# Altium schematic sheet Power.SchDoc
size 297 x 209 mm
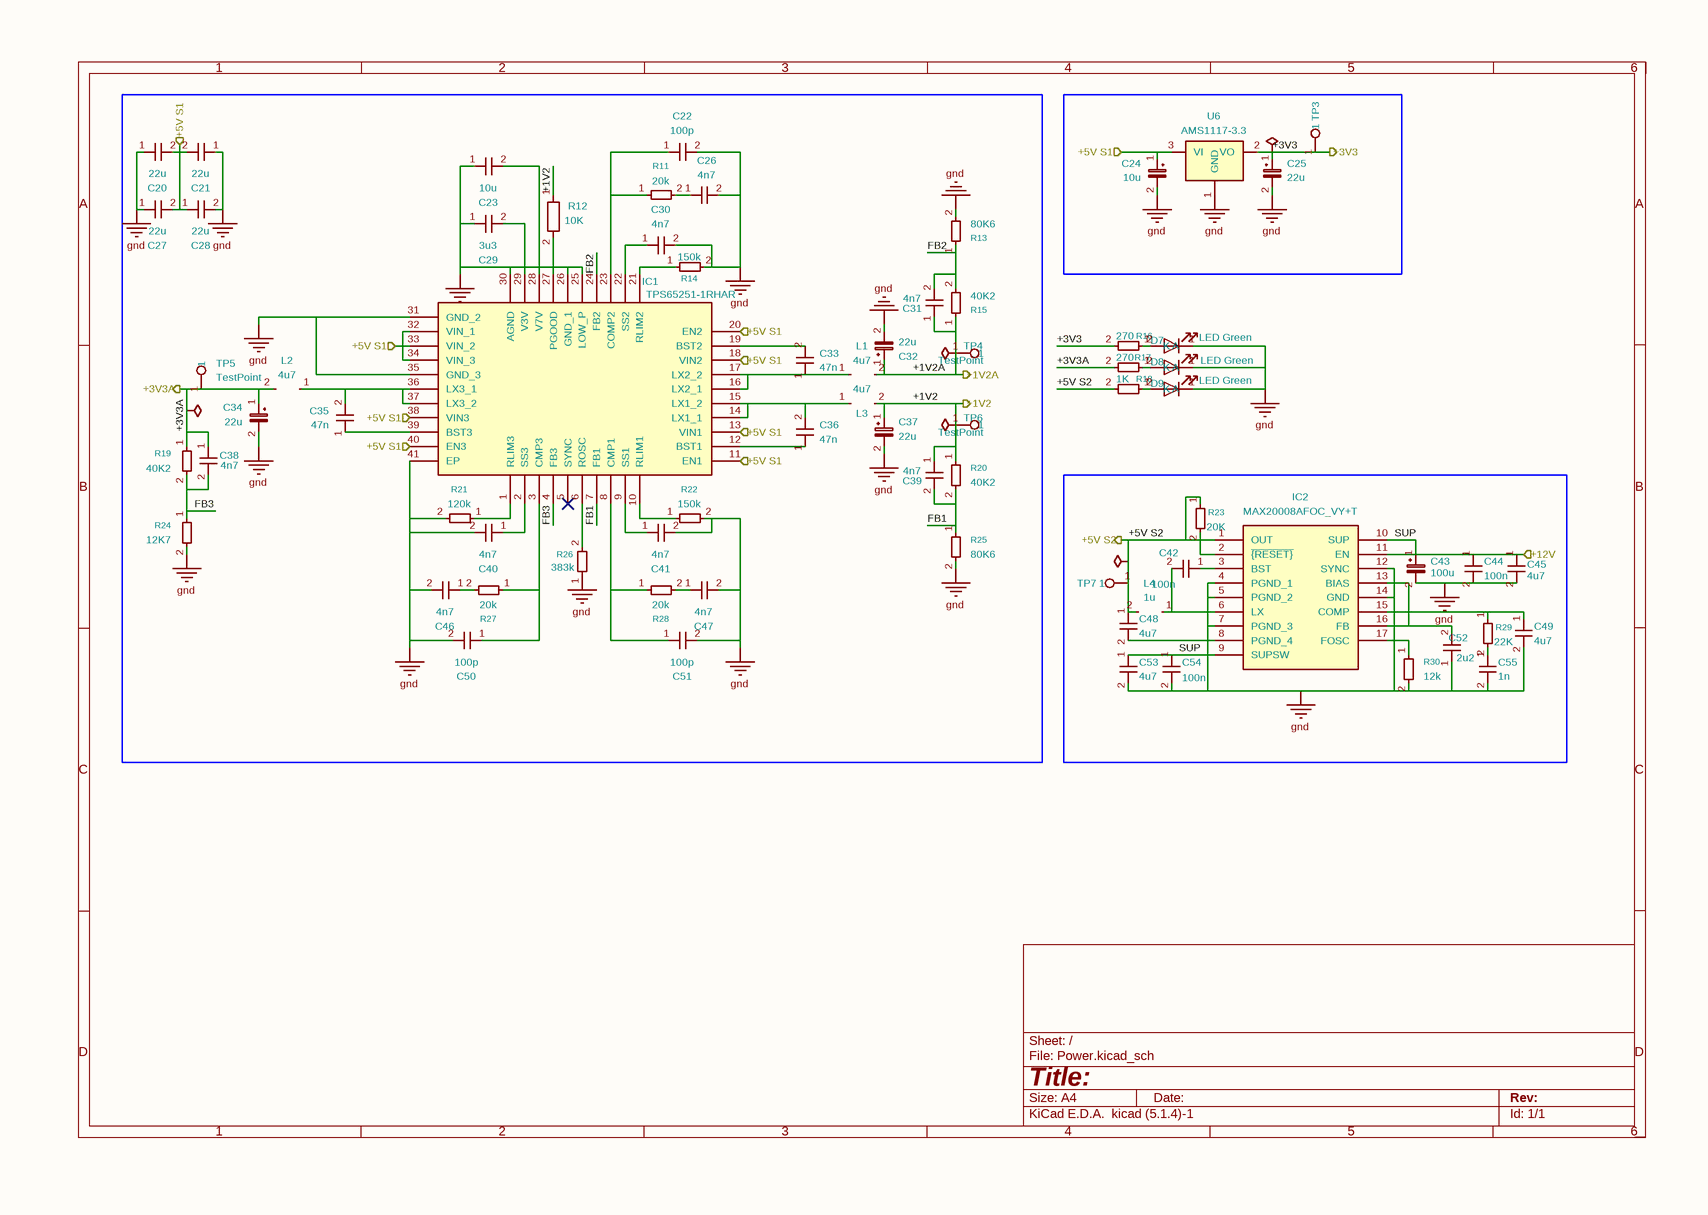
[diagram p0: Power.SchDoc]

## Parts
#FLG04  PWR_FLAG  (value not drawn)  (graphical)
#FLG05  PWR_FLAG  (value not drawn)  (graphical)
#FLG06  PWR_FLAG  (value not drawn)  (graphical)
#FLG07  PWR_FLAG  (value not drawn)  (graphical)
#FLG08  PWR_FLAG  (value not drawn)  (graphical)
C20  22u  [C_0805_2012Metric]
C21  22u  [C_0805_2012Metric]
C22  100p  [C_0402_1005Metric]
C23  10u  [C_0603_1608Metric]
C24  10u  [CAP_EEEFK1H100UR]
C25  22u  [CAP_EEEFK1A220AR]
C26  4n7  [C_0402_1005Metric]
C27  22u  [C_0805_2012Metric]
C28  22u  [C_0805_2012Metric]
C29  3u3  [C_0603_1608Metric]
C30  4n7  [C_0402_1005Metric]
C31  4n7  [C_0402_1005Metric]
C32  22u  [CAP_EEEFK1A220AR]
C33  47n  [C_0402_1005Metric]
C34  22u  [CAP_EEEFK1A220AR]
C35  47n  [C_0402_1005Metric]
C36  47n  [C_0402_1005Metric]
C37  22u  [CAP_EEEFK1A220AR]
C38  4n7  [C_0402_1005Metric]
C39  4n7  [C_0402_1005Metric]
C40  4n7  [C_0402_1005Metric]
C41  4n7  [C_0402_1005Metric]
C42  100n  [C_0603_1608Metric]
C43  100u  [CAP_EEEFTH101XAP]
C44  100n  [C_0402_1005Metric]
C45  4u7  [C_0805_2012Metric]
C46  4n7  [C_0402_1005Metric]
C47  4n7  [C_0402_1005Metric]
C48  4u7  [C_0805_2012Metric]
C49  4u7  [C_0402_1005Metric]
C50  100p  [C_0402_1005Metric]
C51  100p  [C_0402_1005Metric]
C52  2u2  [C_0402_1005Metric]
C53  4u7  [C_0402_1005Metric]
C54  100n  [C_0603_1608Metric]
C55  1n  [C_0402_1005Metric]
D7  LED Green  [LED_0603_1608Metric]
D8  LED Green  [LED_0603_1608Metric]
D9  LED Green  [LED_0603_1608Metric]
IC1  TPS65251-1RHAR  [VQFN-40-1EP_6x6mm_P0.5mm_EP3.5x3.5mm_ThermalVias]
IC2  MAX20008AFOC_VY+T  [MAX20008AFOCVYT]
L1  4u7  [INDPM5050X400N]
L2  4u7  [INDPM5050X400N]
L3  4u7  [INDPM5050X400N]
L4  1u  [SRN5040TA1R0M]
R11  20k  [R_0402_1005Metric]
R12  10K  [R_0603_1608Metric]
R13  80K6  [R_0402_1005Metric]
R14  150k  [R_0402_1005Metric]
R15  40K2  [R_0402_1005Metric]
R16  270  [R_0603_1608Metric]
R17  270  [R_0603_1608Metric]
R18  1K  [R_0603_1608Metric]
R19  40K2  [R_0402_1005Metric]
R20  40K2  [R_0402_1005Metric]
R21  120k  [R_0603_1608Metric]
R22  150k  [R_0603_1608Metric]
R23  20K  [R_0603_1608Metric]
R24  12K7  [R_0402_1005Metric]
R25  80K6  [R_0402_1005Metric]
R26  383k  [R_0402_1005Metric]
R27  20k  [R_0603_1608Metric]
R28  20k  [R_0603_1608Metric]
R29  22K  [C_0402_1005Metric]
R30  12k  [R_0603_1608Metric]
TP3  TestPoint  [TestPoint_Pad_1.0x1.0mm]  (value not drawn)
TP4  TestPoint  [TestPoint_Pad_1.0x1.0mm]
TP5  TestPoint  [TestPoint_Pad_1.0x1.0mm]
TP6  TestPoint  [TestPoint_Pad_1.0x1.0mm]
TP7  TestPoint  [TestPoint_Pad_1.0x1.0mm]  (value not drawn)
U6  AMS1117-3.3  [SOT-223-3_TabPin2]

## Ports
+1V2 (out), +1V2A (out), +3V3 (out), +3V3A (out), +5V S1 (in), +5V S2 (out), +12V (in)

## Nets
gnd: C20.1 C21.1 C22.2 C23.1 C24.2 C25.2 C26.2 C27.1 C28.2 C29.1 C30.2 C32.2 C34.2 C37.2 C40.2 C41.2 C43.2 C44.2 C45.2 C46.2 C47.2 C48.2 C49.2 C50.2 C51.2 C52.1 C53.2 C54.2 C55.2 D7.1(K) D8.1(K) D9.1(K) IC1.25(LOW_P) IC1.26(GND_1) IC1.30(AGND) IC1.31(GND_2) IC1.35(GND_3) IC1.41(EP) IC2.4(PGND_1) IC2.5(PGND_2) IC2.7(PGND_3) IC2.8(PGND_4) IC2.12(SYNC) IC2.14(GND) R13.2 R14.2 R21.2 R22.2 R24.2 R25.2 R26.1 R30.2 U6.1(GND)
+1V2: #FLG07.1 C37.1 C39.1 L3.2 R12.1 R20.1 TP6.1 ; port +1V2
+1V2A: #FLG05.1 C31.1 C32.1 L1.2 R15.1 TP4.1 ; port +1V2A
+3V3: #FLG04.1 C25.1 R16.2 TP3.1 U6.2(VO) ; port +3V3
+3V3A: #FLG06.1 C34.1 C38.1 L2.2 R17.2 R19.1 TP5.1 ; port +3V3A
+5V S1: C20.2 C21.2 C24.1 C27.2 C28.1 IC1.11(EN1) IC1.13(VIN1) IC1.18(VIN2) IC1.20(EN2) IC1.32(VIN_1) IC1.33(VIN_2) IC1.34(VIN_3) IC1.38(VIN3) IC1.40(EN3) U6.3(VI) ; port +5V S1
+5V S2: #FLG08.1 C48.1 IC2.1(OUT) L4.2 R18.2 R23.1 TP7.1 ; port +5V S2
FB1: C39.2 IC1.7(FB1) R20.2 R25.1
FB2: C31.2 IC1.24(FB2) R13.1 R15.2
FB3: C38.2 IC1.4(FB3) R19.2 R24.1
SUP: C43.1 C44.1 C45.1 C53.1 C54.1 IC2.9(SUPSW) IC2.10(SUP) IC2.11(EN) ; port +12V
NetC22_1: C22.1 IC1.23(COMP2) R11.1
NetC23_2: C23.2 IC1.28(V7V)
NetC26_1: C26.1 R11.2
NetC29_2: C29.2 IC1.29(V3V)
NetC30_1: C30.1 IC1.22(SS2)
NetC33_1: C33.1 IC1.16(LX2_1) IC1.17(LX2_2) L1.1
NetC33_2: C33.2 IC1.19(BST2)
NetC35_1: C35.1 IC1.39(BST3)
NetC35_2: C35.2 IC1.36(LX3_1) IC1.37(LX3_2) L2.1
NetC36_1: C36.1 IC1.12(BST1)
NetC36_2: C36.2 IC1.14(LX1_1) IC1.15(LX1_2) L3.1
NetC40_1: C40.1 IC1.2(SS3)
NetC41_1: C41.1 IC1.9(SS1)
NetC42_1: C42.1 IC2.3(BST)
NetC42_2: C42.2 IC2.6(LX) L4.1
NetC46_1: C46.1 R27.2
NetC47_1: C47.1 R28.2
NetC49_1: C49.1 IC2.15(COMP) R29.1
NetC50_1: C50.1 IC1.3(CMP3) R27.1
NetC51_1: C51.1 IC1.8(CMP1) R28.1
NetC52_2: C52.2 IC2.13(BIAS) IC2.16(FB)
NetC55_1: C55.1 R29.2
NetD7_2: D7.2(A) R16.1
NetD8_2: D8.2(A) R17.1
NetD9_2: D9.2(A) R18.1
NetIC1_1: IC1.1(RLIM3) R21.1
NetIC1_6: IC1.6(ROSC) R26.2
NetIC1_10: IC1.10(RLIM1) R22.1
NetIC1_21: IC1.21(RLIM2) R14.1
NetIC1_27: IC1.27(PGOOD) R12.2
NetIC2_2: IC2.2(~{{RESET}}) R23.2
NetIC2_17: IC2.17(FOSC) R30.1

Not connected (* = marked no-connect by the designer): IC1 5(SYNC)*

## Notes on the sheet
- 1
- 2
- 3
- 4
- 5
- 6
- A
- B
- C
- D
- Title:
- File: Power.kicad_sch
- Sheet: /
- KiCad E.D.A.  kicad (5.1.4)-1
- Size: A4
- Date:
- Rev:
- Id: 1/1

## Library data of the parts
#FLG04 #FLG05 #FLG06 #FLG07 #FLG08 = PWR_FLAG: Description: Special symbol for telling ERC where power comes from; Value: PWR_FLAG
C20-C23 C26-C31 C33 C35 C36 C38-C42 C44-C55 = C_Small: Description: Unpolarized capacitor, small symbol
  C20 C21 C27 C28: Value: 22u; Footprint: Capacitor_SMD:C_0805_2012Metric
  C22 C50 C51: Value: 100p; Footprint: Capacitor_SMD:C_0402_1005Metric
  C23: Value: 10u; Footprint: Capacitor_SMD:C_0603_1608Metric
  C26 C30 C31 C38-C41 C46 C47: Value: 4n7; Footprint: Capacitor_SMD:C_0402_1005Metric
  C29: Value: 3u3; Footprint: Capacitor_SMD:C_0603_1608Metric
  C33 C35 C36: Value: 47n; Footprint: Capacitor_SMD:C_0402_1005Metric
  C42 C54: Value: 100n; Footprint: Capacitor_SMD:C_0603_1608Metric
  C44: Value: 100n; Footprint: Capacitor_SMD:C_0402_1005Metric
  C45 C48: Value: 4u7; Footprint: Capacitor_SMD:C_0805_2012Metric
  C49 C53: Value: 4u7; Footprint: Capacitor_SMD:C_0402_1005Metric
  C52: Value: 2u2; Footprint: Capacitor_SMD:C_0402_1005Metric
  C55: Value: 1n; Footprint: Capacitor_SMD:C_0402_1005Metric
C24 C25 C32 C34 C37 C43 = C_Polarized_Small: Description: Polarized capacitor, small symbol
  C24: Value: 10u; Footprint: EEEFK1H100UR:CAP_EEEFK1H100UR
  C25 C32 C34 C37: Value: 22u; Footprint: EEEFK1A220AR:CAP_EEEFK1A220AR
  C43: Value: 100u; Footprint: EEE_FTH101XAP:CAP_EEEFTH101XAP
D7-D9 = LED: Part Description: Green 572nm LED Indication - Discrete 2.2V 2-SMD, No Lead; Field4: Digikey; Field5: LTST-S270KGKT; Field6: SML-A12M8TT86N; Field7: Rohm; Field8: 650263301; Value: LED Green; Footprint: LED_SMD:LED_0603_1608Metric
IC1 = TPS65251-1RHAR: Manufacturer_Name: Texas Instruments; Description: 4.5-V to 18-V input, 3A/2A/2A output, Synchronous triple buck converter; Height: 1; Manufacturer_Part_Number: TPS65251-1RHAR; Mouser Part Number: 595-TPS65251-1RHAR; Mouser Price/Stock: https://www.mouser.co.uk/ProductDetail/Texas-Instruments/TPS65251-1RHAR?qs=JRStGrVgRuSy8em9PUe0zA%3D%3D; Arrow Part Number: TPS65251-1RHAR; Arrow Price/Stock: https://www.arrow.com/en/products/tps65251-1rhar/texas-instruments?region=nac; Value: TPS65251-1RHAR; Footprint: Package_DFN_QFN:VQFN-40-1EP_6x6mm_P0.5mm_EP3.5x3.5mm_ThermalVias
IC2 = MAX20008AFOC_VY+T: Manufacturer_Name: Analog Devices; Manufacturer_Part_Number: MAX20008AFOC/VY+T; Description: Switching Voltage Regulators 36V, 220kHz to 2.2MHz, 4A/6A/8A Fully integrated step down converter; Height: 0.75; Mouser Part Number: 700-MAX20008AFOC/VYT; Mouser Price/Stock: https://www.mouser.co.uk/ProductDetail/Analog-Devices-Maxim-Integrated/MAX20008AFOC-VY%2bT?qs=vLWxofP3U2wvQQR8GkDmgw%3D%3D; Arrow Part Number: MAX20008AFOC/VY+T; Arrow Price/Stock: https://www.arrow.com/en/products/max20008afocvyt/maxim-integrated?region=nac; Value: MAX20008AFOC_VY+T; Footprint: MAX20008AFOC_VY+T:MAX20008AFOCVYT
L1-L4 = L_Small: Description: Inductor, small symbol
  L1-L3: Value: 4u7; Footprint: SRN5040-4R7M:INDPM5050X400N
  L4: Value: 1u; Footprint: SRN5040TA-1R0M:SRN5040TA1R0M
R11 R13-R30 = R_Small: Description: Resistor, small symbol
  R11: Value: 20k; Footprint: Resistor_SMD:R_0402_1005Metric
  R13 R25: Value: 80K6; Footprint: Resistor_SMD:R_0402_1005Metric
  R14: Value: 150k; Footprint: Resistor_SMD:R_0402_1005Metric
  R15 R19 R20: Value: 40K2; Footprint: Resistor_SMD:R_0402_1005Metric
  R16 R17: Value: 270; Footprint: Resistor_SMD:R_0603_1608Metric
  R18: Value: 1K; Footprint: Resistor_SMD:R_0603_1608Metric
  R21: Value: 120k; Footprint: Resistor_SMD:R_0603_1608Metric
  R22: Value: 150k; Footprint: Resistor_SMD:R_0603_1608Metric
  R23: Value: 20K; Footprint: Resistor_SMD:R_0603_1608Metric
  R24: Value: 12K7; Footprint: Resistor_SMD:R_0402_1005Metric
  R26: Value: 383k; Footprint: Resistor_SMD:R_0402_1005Metric
  R27 R28: Value: 20k; Footprint: Resistor_SMD:R_0603_1608Metric
  R29: Value: 22K; Footprint: Capacitor_SMD:C_0402_1005Metric
  R30: Value: 12k; Footprint: Resistor_SMD:R_0603_1608Metric
R12 = R: Value: 10K; Footprint: Resistor_SMD:R_0603_1608Metric
U6 = AMS1117-3.3: Description: 1A Low Dropout regulator, positive, 3.3V fixed output, SOT-223; Value: AMS1117-3.3; Footprint: Package_TO_SOT_SMD:SOT-223-3_TabPin2
TP3-TP7 = TestPoint: Description: test point; Value: TestPoint; Footprint: TestPoint:TestPoint_Pad_1.0x1.0mm